# Altium project loz-old-man.PrjPcb (part 2 of 5)

## Sheet LCD_IO.SchDoc
size B; DocumentNumber: 12; SheetNumber: 12; SheetTotal: 14; PAGE_TITLE: -
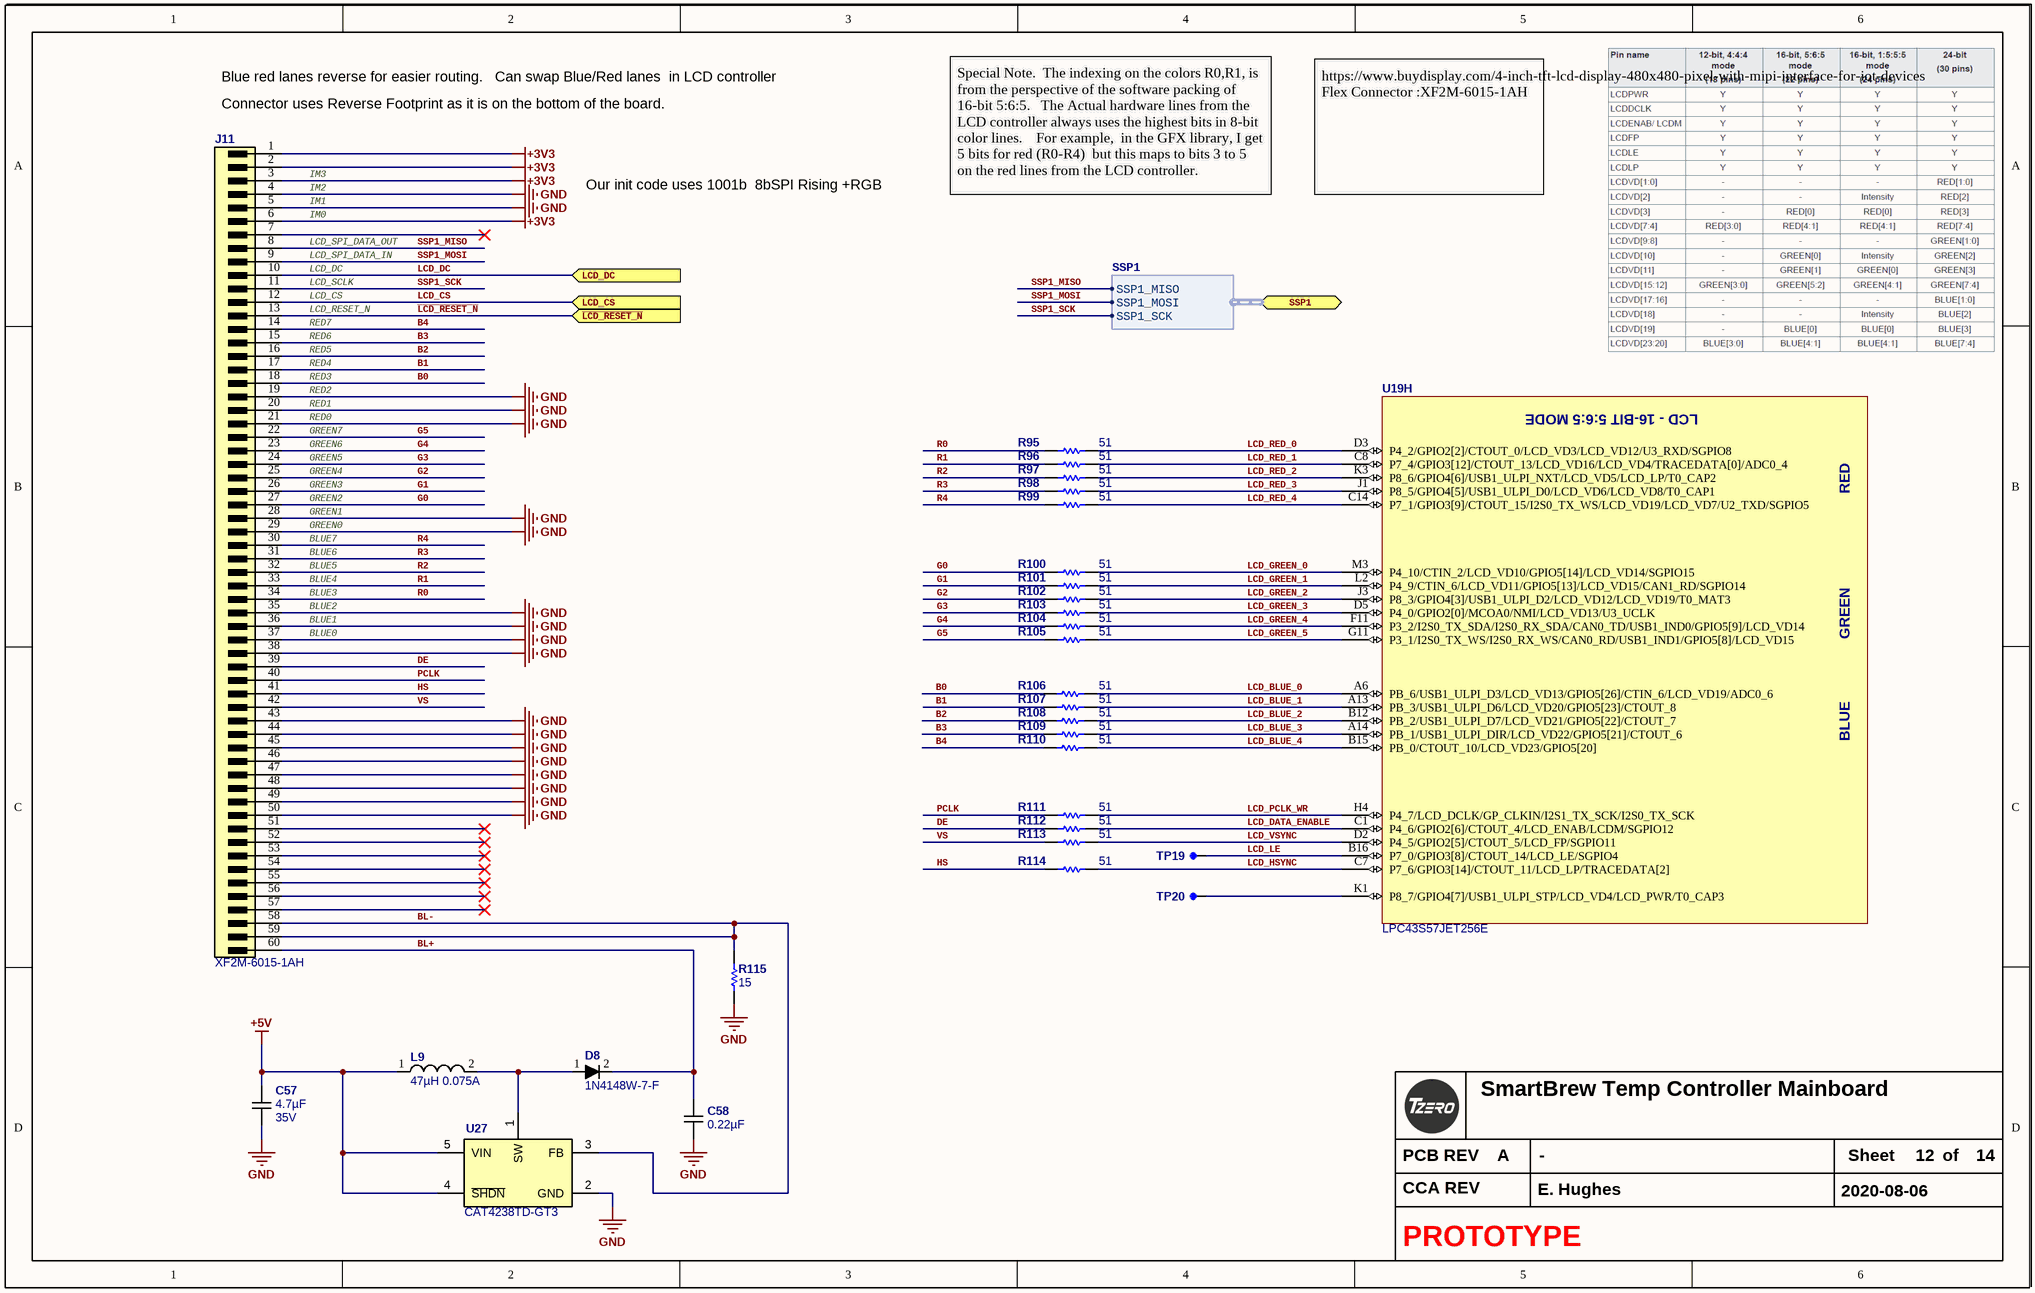
[diagram p3: LCD_IO.SchDoc]

### Parts
C57  4.7µF  Voltage - Rated: 35V  [C0805_1.50MM_HD]
C58  0.22µF  [C0603_0.90MM_HD]
D8  1N4148W-7-F  [D_SOD-123_P]
J11  XF2M-6015-1AH  [XF2M-6015-1AH - Reverse]
L9  47µH 0.075A  [L0805_1.45MM_MD]
R95  51  [R0603_0.55MM_MD]
R96  51  [R0603_0.55MM_MD]
R97  51  [R0603_0.55MM_MD]
R98  51  [R0603_0.55MM_MD]
R99  51  [R0603_0.55MM_MD]
R100  51  [R0603_0.55MM_MD]
R101  51  [R0603_0.55MM_MD]
R102  51  [R0603_0.55MM_MD]
R103  51  [R0603_0.55MM_MD]
R104  51  [R0603_0.55MM_MD]
R105  51  [R0603_0.55MM_MD]
R106  51  [R0603_0.55MM_MD]
R107  51  [R0603_0.55MM_MD]
R108  51  [R0603_0.55MM_MD]
R109  51  [R0603_0.55MM_MD]
R110  51  [R0603_0.55MM_MD]
R111  51  [R0603_0.55MM_MD]
R112  51  [R0603_0.55MM_MD]
R113  51  [R0603_0.55MM_MD]
R114  51  [R0603_0.55MM_MD]
R115  15  [R0603_0.55MM_MD]
TP19  (no value)  [TP_SMT_25_MIL_ROUND]  (net tie, no BOM)
TP20  (no value)  [TP_SMT_25_MIL_ROUND]  (net tie, no BOM)
U19  LPC43S57JET256E  [LBGA256 16X16 1700X1700X155]  (part H of 10)
U27  CAT4238TD-GT3  [SOT23-5]

### Ports
LCD_CS (in), LCD_DC (in), SSP1 (bidir, harness SSP1), ~{LCD_RESET_N} (in)

### Harnesses
SSP1: SSP1_MISO, SSP1_MOSI, SSP1_SCK

### Nets
+3V3: J11.1 J11.2 J11.3 J11.6
+5V: C57.2 L9.1 U27.4(~{SHDN}) U27.5(VIN)
GND: C57.1 C58.1 J11.4 J11.5 J11.19 J11.20 J11.21 J11.28 J11.29 J11.35 J11.36 J11.37 J11.38(XR) J11.43 J11.44 J11.45 J11.46 J11.47 J11.48 J11.49 J11.50 R115.1 U27.2(GND)
~{LCD_RESET_N}: J11.13 ; port ~{LCD_RESET_N}
B0: J11.18 R106.1
B1: J11.17 R107.1
B2: J11.16 R108.1
B3: J11.15 R109.1
B4: J11.14 R110.1
BL+: C58.2 D8.2(K) J11.60
BL-: J11.58 J11.59 R115.2 U27.3(FB)
DE: J11.39 R112.1
G0: J11.27 R100.1
G1: J11.26 R101.1
G2: J11.25 R102.1
G3: J11.24 R103.1
G4: J11.23 R104.1
G5: J11.22 R105.1
HS: J11.41 R114.1
LCD_BLUE_0: R106.2 U19.A6(PB_6/USB1_ULPI_D3/LCD_VD13/GPIO5[26]/CTIN_6/LCD_VD19/ADC0_6)
LCD_BLUE_1: R107.2 U19.A13(PB_3/USB1_ULPI_D6/LCD_VD20/GPIO5[23]/CTOUT_8)
LCD_BLUE_2: R108.2 U19.B12(PB_2/USB1_ULPI_D7/LCD_VD21/GPIO5[22]/CTOUT_7)
LCD_BLUE_3: R109.2 U19.A14(PB_1/USB1_ULPI_DIR/LCD_VD22/GPIO5[21]/CTOUT_6)
LCD_BLUE_4: R110.2 U19.B15(PB_0/CTOUT_10/LCD_VD23/GPIO5[20])
LCD_CS: J11.12 ; port LCD_CS
LCD_DATA_ENABLE: R112.2 U19.C1(P4_6/GPIO2[6]/CTOUT_4/LCD_ENAB/LCDM/SGPIO12)
LCD_DC: J11.10 ; port LCD_DC
LCD_GREEN_0: R100.2 U19.M3(P4_10/CTIN_2/LCD_VD10/GPIO5[14]/LCD_VD14/SGPIO15)
LCD_GREEN_1: R101.2 U19.L2(P4_9/CTIN_6/LCD_VD11/GPIO5[13]/LCD_VD15/CAN1_RD/SGPIO14)
LCD_GREEN_2: R102.2 U19.J3(P8_3/GPIO4[3]/USB1_ULPI_D2/LCD_VD12/LCD_VD19/T0_MAT3)
LCD_GREEN_3: R103.2 U19.D5(P4_0/GPIO2[0]/MCOA0/NMI/LCD_VD13/U3_UCLK)
LCD_GREEN_4: R104.2 U19.F11(P3_2/I2S0_TX_SDA/I2S0_RX_SDA/CAN0_TD/USB1_IND0/GPIO5[9]/LCD_VD14)
LCD_GREEN_5: R105.2 U19.G11(P3_1/I2S0_TX_WS/I2S0_RX_WS/CAN0_RD/USB1_IND1/GPIO5[8]/LCD_VD15)
LCD_HSYNC: R114.2 U19.C7(P7_6/GPIO3[14]/CTOUT_11/LCD_LP/TRACEDATA[2])
LCD_LE: TP19.1 U19.B16(P7_0/GPIO3[8]/CTOUT_14/LCD_LE/SGPIO4)
LCD_PCLK_WR: R111.2 U19.H4(P4_7/LCD_DCLK/GP_CLKIN/I2S1_TX_SCK/I2S0_TX_SCK)
LCD_RED_0: R95.2 U19.D3(P4_2/GPIO2[2]/CTOUT_0/LCD_VD3/LCD_VD12/U3_RXD/SGPIO8)
LCD_RED_1: R96.2 U19.C8(P7_4/GPIO3[12]/CTOUT_13/LCD_VD16/LCD_VD4/TRACEDATA[0]/ADC0_4)
LCD_RED_2: R97.2 U19.K3(P8_6/GPIO4[6]/USB1_ULPI_NXT/LCD_VD5/LCD_LP/T0_CAP2)
LCD_RED_3: R98.2 U19.J1(P8_5/GPIO4[5]/USB1_ULPI_D0/LCD_VD6/LCD_VD8/T0_CAP1)
LCD_RED_4: R99.2 U19.C14(P7_1/GPIO3[9]/CTOUT_15/I2S0_TX_WS/LCD_VD19/LCD_VD7/U2_TXD/SGPIO5)
LCD_VSYNC: R113.2 U19.D2(P4_5/GPIO2[5]/CTOUT_5/LCD_FP/SGPIO11)
PCLK: J11.40 R111.1
R0: J11.34 R95.1
R1: J11.33 R96.1
R2: J11.32 R97.1
R3: J11.31 R98.1
R4: J11.30 R99.1
SSP1_MISO: J11.8 ; port SSP1.SSP1_MISO
SSP1_MOSI: J11.9 ; port SSP1.SSP1_MOSI
SSP1_SCK: J11.11 ; port SSP1.SSP1_SCK
VS: J11.42 R113.1
NetD8_1: D8.1(A) L9.2 U27.1(SW)
NetTP20_1: TP20.1 U19.K1(P8_7/GPIO4[7]/USB1_ULPI_STP/LCD_VD4/LCD_PWR/T0_CAP3)

Not connected (* = marked no-connect by the designer): J11 7* 51* 52* 53* 54* 55* 56* 57*

### Notes on the sheet
- Blue red lanes reverse for easier routing.   Can swap Blue/Red lanes  in LCD controller
- (near J11) Connector uses Reverse Footprint as it is on the bottom of the board.
- (near J11) IM3
- (near J11) IM2
- (near J11) IM1
- (near J11) IM0
- Our init code uses 1001b  8bSPI Rising +RGB
- Special Note.  The indexing on the colors R0,R1, is from the perspective of the software packing of 16-bit 5:6:5.   The Actual hardware lines from the LCD controller always uses the highest bits in 8-bit color lines.    For example,  in the GFX library, I get 5 bits for red (R0-R4)  but this maps to bits 3 to 5 on the red lines from the LCD controller.
- https://www.buydisplay.com/4-inch-tft-lcd-display-480x480-pixel-with-mipi-interface-for-iot-devices
  Flex Connector :XF2M-6015-1AH
- (near J11) LCD_DC
- (near J11) LCD_SPI_DATA_OUT
- (near J11) LCD_SPI_DATA_IN
- (near J11) LCD_SCLK
- (near J11) LCD_CS
- (near J11) RED4
- (near J11) RED5
- (near J11) RED6
- (near J11) RED7
- (near J11) LCD_RESET_N
- (near J11) RED0
- (near J11) RED1
- (near J11) RED2
- (near J11) RED3
- (near J11) GREEN7
- (near J11) GREEN2
- (near J11) GREEN3
- (near J11) GREEN4
- (near J11) GREEN5
- (near J11) GREEN6
- (near J11) GREEN0
- (near J11) GREEN1
- (near J11) BLUE5
- (near J11) BLUE6
- (near J11) BLUE7
- (near J11) BLUE0
- (near J11) BLUE1
- (near J11) BLUE2
- (near J11) BLUE3
- (near J11) BLUE4
- PCB REV
- Sheet
- of
- CCA REV
- (in symbol LPC43S57JET256E, part H) LCD - 16-BIT 5:6:5 MODE; RED; GREEN; BLUE

### Library data of the parts
C57 = CGA4J1X7R1V475K125AE: CAP CER 4.7UF 35V X7R 0805; Manufacturer: TDK Corporation; Tolerance: ±10%; Substitution Notes: 4.7µF , 35V , ±10% , X7R , -55°C ~ 125°C , AEC-Q200 , 0805; Value: 4.7µF; Temperature Coefficient: X7R; Manufacturer Part Number: CGA4J1X7R1V475K125AE; ComponentLink1Description: Datasheet (Internal); ComponentLink1URL: datasheets\TDK\mlcc_automotive_general_en.pdf; ComponentLink2Description: Datasheet (External); ComponentLink2URL: https://product.tdk.com/info/en/catalog/datasheets/mlcc_automotive_general_en.pdf; Supplier 1: Digikey; Supplier Part Number 1: 445-172479-1-ND; Category: Capacitors; Features: Soft Termination; Operating Temperature: -55°C ~ 125°C; Ratings: AEC-Q200; Package: 0805; Thickness (Max): 1.50MM
C58 = CGA3E3X7R1H224K080AB: CAP CER 0.22UF 50V X7R 0603; Manufacturer: TDK Corporation; Tolerance: ±10%; Substitution Notes: 0.22µF , 50V , ±10% , X7R , -55°C ~ 125°C , AEC-Q200 , 0603; Value: 0.22µF; Temperature Coefficient: X7R; Manufacturer Part Number: CGA3E3X7R1H224K080AB; ComponentLink1Description: Datasheet (Internal); ComponentLink1URL: datasheets\TDK\mlcc_automotive_general_en.pdf; ComponentLink2Description: Datasheet (External); ComponentLink2URL: https://product.tdk.com/info/en/catalog/datasheets/mlcc_automotive_general_en.pdf; Supplier 1: Digikey; Supplier Part Number 1: 445-6926-1-ND; Category: Capacitors; Voltage - Rated: 50V; Features: -; Operating Temperature: -55°C ~ 125°C; Ratings: AEC-Q200; Package: 0603; Thickness (Max): 0.90MM
D8 = 1N4148W-7-F: DIODE SWITCH 100V 150MA SOD123; Manufacturer: Diodes Inc; CategorySort: 400; Diode Type: Standard; Voltage - Forward (Vf) (Max) @ If: 1.25V @ 150mA; Speed: Small Signal =< 200mA (Io)- Any Speed; Reverse Recovery Time (trr): 4ns; Current - Reverse Leakage @ Vr: 1µA @ 75V; Capacitance @ Vr- F: 2pF @ 0V- 1MHz; Num Pins: 2; Diode Suffix: 1A_2C; Category: Diodes; Value: 1N4148W-7-F; Manufacturer Part Number: 1N4148W-7-F; ComponentLink1Description: Internal Datasheet; ComponentLink1URL: http://www.diodes.com/datasheets/ds30086.pdf; ComponentLink2Description: External Datasheet; ComponentLink2URL: http://www.diodes.com/datasheets/ds30086.pdf; Supplier 1: Digi-Key; Supplier Part Number 1: 1N4148W-FDICT-ND; SortValue: 1N4148W-7-F; Voltage - DC Reverse (Vr) (Max): 100V; Current - Average Rectified (Io): 150mA; Mounting Type: Surface Mount; Package: SOD-123; Supplier Device Package: SOD-123; Packaging: Cut Tape (CT)
J11 = XF2M-6015-1AH: CONN FPC 60POS 0.50MM R/A; Manufacturer: Omron; Actuator Material: Polymer,Liquid Crystal Polymer; Voltage Rating: 50V; Current Rating: 500mA; Number of Positions: 60; Gender: Receptacle; Pitch: 0.5mm; Contact Resistance: 50mR; Value: XF2M-6015-1AH; Supplier 1: Newark; Manufacturer Part Number: XF2M-6015-1AH; Stock 1: 1054; Pricing 1: 1=0.63900, 10=0.63900, 25=0.63900, 50=0.63900, 100=0.63900, 250=0.63900, 500=0.63900 (USD); RoHS: Yes; Mount: Surface Mount; Contact Material: Copper Alloy; Contact Plating: Gold; Housing Material: Polymer; Min Operating Temperature: -30°C; Max Operating Temperature: 85°C; Packaging: Tape and Reel; Number of Rows: 1; Termination: Solder; Orientation: Right Angle; Package Quantity: 1; Flammability Rating: UL94 V-0; REACH SVHC: Unknown; ComponentLink1URL: https://datasheet.ciiva.com/26945/getdatasheetpartid-792262-26945584.pdf?src-supplier=Verical; ComponentLink1Description: https://datasheet.ciiva.com/26945/getdatasheetpartid-792262-26945584.pdf?src-supplier=Verical; ComponentLink2URL: https://datasheet.ciiva.com/672/en-xf2m-672256.pdf?src-supplier=Digi-Key; ComponentLink2Description: https://datasheet.ciiva.com/672/en-xf2m-672256.pdf?src-supplier=Digi-Key; ComponentLink3URL: https://datasheet.ciiva.com/10367/xf2m-10367321.pdf?src-supplier=Avnet; ComponentLink3Description: https://datasheet.ciiva.com/10367/xf2m-10367321.pdf?src-supplier=Avnet; ComponentLink4URL: https://datasheet.ciiva.com/16122/en-xf2m-16122554.pdf?src-supplier=Onlinecomponents.com; ComponentLink4Description: https://datasheet.ciiva.com/16122/en-xf2m-16122554.pdf?src-supplier=Onlinecomponents.com; Supplier Part Number 1: 88M4894; Housing Color: Natural; Max Current Rating: 500mA; Max Voltage Rating (DC): 50V; Max Voltage Rating (AC): 50V; Number of Contacts: 60; Length: 34.1mm; Depth: 6.2mm; Lead Free: Lead Free; ComponentLink5URL: https://datasheet.ciiva.com/672/en-xf2m-672255.pdf?src-supplier=Digi-Key; ComponentLink5Description: https://datasheet.ciiva.com/672/en-xf2m-672255.pdf?src-supplier=Digi-Key; ComponentLink6URL: https://datasheet.ciiva.com/7989/1465437-7989453.pdf?src-supplier=Element14; ComponentLink6Description: https://datasheet.ciiva.com/7989/1465437-7989453.pdf?src-supplier=Element14; ComponentLink7URL: https://datasheet.ciiva.com/672/en-xf2m-672254.pdf?src-supplier=Digi-Key; ComponentLink7Description: https://datasheet.ciiva.com/672/en-xf2m-672254.pdf?src-supplier=Digi-Key
L9 = LBR2012T470KV: Inductor 47µH 0.075A; Manufacturer: Taiyo Yuden; CategorySort: 300; Inductance (uH): 47; Tolerance: ±10%; DCR Max (Ohms): 1.7Ohm; SRF typ (MHz): 11MHz; Isat (A): 0.075; Shielding: Unshielded; Category: Inductors; Value: 47µH 0.075A; Part Number: LBR2012T470KV; ComponentLink1Description: External Datasheet; ComponentLink1URL: https://ds.yuden.co.jp/TYCOMPAS/ut/detail?pn=LBR2012T470KV  &u=M; Sort Value: 47_0.075; Sort Value Package: 47_0.075_0805; Manufacturer Part Number: LBR2012T470KV; IRMS: 0.075; Supplier 1: Digikey; Supplier Part Number 1: 587-4044-1-ND; Supplier Unit Price 1: 0.25; Package: 0805; Height (mm): 1.45MM; Rating: AEC-Q200
R95-R114 = ERJ-3EKF51R0V: RES 51 OHM 1/10W 1% 0603 SMD; Manufacturer: Panasonic Electronic Components; Package Power: 0603  (0.1W); Power (Watts): 0.1W- 1/10W; Temperature Coefficient: ±100ppm/°C; Limiting Element Voltage: 75; Maximum Overload Voltage: 150; Maximum Working Voltage: 2.3V; Substitution Notes: 51 , ±1% , 0603 , AEC-Q200; Value: 51; Manufacturer Part Number: ERJ-3EKF51R0V; ComponentLink1Description: Internal Datasheet; ComponentLink1URL: datasheets\Panasonic Electronic Components\AOA0000CE2.pdf; ComponentLink2Description: External Datasheet; ComponentLink2URL: http://industrial.panasonic.com/www-data/pdf/AOA0000/AOA0000CE2.pdf; Supplier 1: Digi-Key; Supplier Part Number 1: P51.0HCT-ND; Category: Resistors; Resistance (Ohms): 51; Composition: Thick Film; Features: -; Tolerance: ±1%; Package: 0603 (1608 Metric); Supplier Package: 0603; Size / Dimension: 0.063" L x 0.031" W (1.60mm x 0.80mm); Height: 0.55MM; Number of Terminations: 2; Packaging: Cut Tape (CT); Sort Value: 51; Sort Value Package: 603_51; Ratings: AEC-Q200
R115 = ERJ-3EKF15R0V: RES 15 OHM 1/10W 1% 0603 SMD; Manufacturer: Panasonic Electronic Components; Package Power: 0603  (0.1W); Power (Watts): 0.1W- 1/10W; Temperature Coefficient: ±100ppm/°C; Limiting Element Voltage: 75; Maximum Overload Voltage: 150; Maximum Working Voltage: 1.2V; Substitution Notes: 15 , ±1% , 0603 , AEC-Q200; Value: 15; Manufacturer Part Number: ERJ-3EKF15R0V; ComponentLink1Description: Internal Datasheet; ComponentLink1URL: datasheets\Panasonic Electronic Components\AOA0000CE2.pdf; ComponentLink2Description: External Datasheet; ComponentLink2URL: http://industrial.panasonic.com/www-data/pdf/AOA0000/AOA0000CE2.pdf; Supplier 1: Digi-Key; Supplier Part Number 1: P15.0HCT-ND; Category: Resistors; Resistance (Ohms): 15; Composition: Thick Film; Features: -; Tolerance: ±1%; Package: 0603 (1608 Metric); Supplier Package: 0603; Size / Dimension: 0.063" L x 0.031" W (1.60mm x 0.80mm); Height: 0.55MM; Number of Terminations: 2; Packaging: Cut Tape (CT); Sort Value: 15; Sort Value Package: 603_15; Ratings: AEC-Q200
TP19 TP20 = TP SMT 25MIL: Sort Value: *; Category: *; CategorySort: *
U19 = LPC43S57JET256E: ARM Microcontrollers - MCU CortexM0/4 32bit 1MB Cortex-M4/M0; Manufacturer: NXP Semiconductors; CategorySort: 600; Data RAM Size: 136 KB; Core: ARM Cortex M4/M0; Maximum Clock Frequency: 204 MHz; On-Chip ADC: Yes; Operating Supply Voltage: 2.2 V to 3.6 V; Processor Series: LPC4357; Product Status: New Technology; Value: LPC43S57JET256E; Sort Value: *; Category: Integrated Circuits; Supplier 1: Digi-Key; Supplier Part Number 1: 568-11712-ND; Manufacturer Part Number: LPC43S57JET256E; RoHS: RoHS Compliant; Stock 1: 108; Pricing 1: 1=14.40, 25=13.31, 100=12.24, 250=11.16, 500=10.43, 1000=9.57 (USD); Package: LBGA-256; Packaging: Tray; Mounting Style: SMD/SMT; Program Memory Size: 1 MB; Data Bus Width: 32 bit; Maximum Operating Temperature: + 85 C; Minimum Operating Temperature: - 40 C; Standard Pack Qty: 90; Tradename: LPC; RoHS - Mouser: Y; Minimum Order Quantity: 1; Reeling: False; ComponentLink1URL: http://www.nxp.com/documents/data_sheet/LPC4357_53_37_33.pdf; ComponentLink1Description: http://www.nxp.com/documents/data_sheet/LPC4357_53_37_33.pdf
U27 = CAT4238TD-GT3: IC LED DRIVER RGLTR DIM TSOT23-5; Manufacturer: ON Semiconductor; Output Current: 450mA; Output Voltage: 38V; Max Supply Voltage: 5.5V; Number of Outputs: 1; Frequency: 1.3MHz; Min Input Voltage: 2V; Switching Frequency: 1MHz; Max Supply Current: 1.5mA; High Level Output Current: 40mA; Number of Segments: 10; Topology: Boost; Min Supply Voltage: 2.8V; Current Rating: 30mA; Efficiency: 87%; Min Output Voltage: 0uV; Value: CAT4238TD-GT3; Supplier 1: Digi-Key; Supplier Part Number 1: CAT4238TD-GT3CT-ND; Manufacturer Part Number: CAT4238TD-GT3; RoHS: Yes; Category: Embedded Processors and Controllers; Stock: 29128; Pricing: 1=1.08000, 10=0.96100, 100=0.70040, 500=0.58642, 1000=0.45611 (USD); Case/Package: TSOT; Number of Pins: 5; Contact Plating: Gold; Min Operating Temperature: -40°C; Max Operating Temperature: 85°C; Package Quantity: 1; Max Input Voltage: 5.5V; Packaging: Tape and Reel; Output Current per Channel: 40mA; Max Output Voltage: 38V; Nominal Supply Current: 1.5mA; Termination: SMD/SMT; Radiation Hardening: No; REACH SVHC: No SVHC; Lead Free: Lead Free; Halogen Free: Halogen Free; ComponentLink1URL: https://datasheet.ciiva.com/4426/cat4238-d-109064-4426950.pdf?src-supplier=Mouser; ComponentLink1Description: https://datasheet.ciiva.com/4426/cat4238-d-109064-4426950.pdf?src-supplier=Mouser; ComponentLink2URL: https://datasheet.ciiva.com/1552/83817-1552601.pdf?src-supplier=Farnell; ComponentLink2Description: https://datasheet.ciiva.com/1552/83817-1552601.pdf?src-supplier=Farnell; ComponentLink3URL: https://datasheet.ciiva.com/15135/getdatasheetpartid-558497-15135587.pdf?src-supplier=Verical; ComponentLink3Description: https://datasheet.ciiva.com/15135/getdatasheetpartid-558497-15135587.pdf?src-supplier=Verical; ComponentLink4URL: https://datasheet.ciiva.com/5775/cat4238-d-5775332.pdf?src-supplier=Farnell; ComponentLink4Description: https://datasheet.ciiva.com/5775/cat4238-d-5775332.pdf?src-supplier=Farnell; ComponentLink5URL: https://datasheet.ciiva.com/26878/cat4238td-gt3-26878318.pdf?src-supplier=IIIC; ComponentLink5Description: https://datasheet.ciiva.com/26878/cat4238td-gt3-26878318.pdf?src-supplier=IIIC; ComponentLink6URL: https://datasheet.ciiva.com/16387/cat4238-d-16387237.pdf?src-supplier=Future+Electronics; ComponentLink6Description: https://datasheet.ciiva.com/16387/cat4238-d-16387237.pdf?src-supplier=Future+Electronics; ComponentLink7URL: https://datasheet.ciiva.com/1945/cat4238-d-1945306.pdf?src-supplier=Digi-Key; ComponentLink7Description: https://datasheet.ciiva.com/1945/cat4238-d-1945306.pdf?src-supplier=Digi-Key; ComponentLink8URL: https://datasheet.ciiva.com/46408/cat4238-d-46408090.pdf?src-supplier=Element14; ComponentLink8Description: https://datasheet.ciiva.com/46408/cat4238-d-46408090.pdf?src-supplier=Element14; ComponentLink9URL: https://datasheet.ciiva.com/1945/cat4238-d-1945307.pdf?src-supplier=Digi-Key; ComponentLink9Description: https://datasheet.ciiva.com/1945/cat4238-d-1945307.pdf?src-supplier=Digi-Key; ComponentLink10URL: https://datasheet.ciiva.com/26062/cat4238-d-26062715.pdf?src-supplier=Avnet+Europe; ComponentLink10Description: https://datasheet.ciiva.com/26062/cat4238-d-26062715.pdf?src-supplier=Avnet+Europe; ComponentLink11URL: https://datasheet.ciiva.com/1497/cat4238-d-1497804.pdf?src-supplier=Element14; ComponentLink11Description: https://datasheet.ciiva.com/1497/cat4238-d-1497804.pdf?src-supplier=Element14; ComponentLink12URL: https://datasheet.ciiva.com/1945/cat4238-d-1945308.pdf?src-supplier=Digi-Key; ComponentLink12Description: https://datasheet.ciiva.com/1945/cat4238-d-1945308.pdf?src-supplier=Digi-Key; ComponentLink13URL: https://datasheet.ciiva.com/3165/cat4238-d-3165884.pdf?src-supplier=Avnet; ComponentLink13Description: https://datasheet.ciiva.com/3165/cat4238-d-3165884.pdf?src-supplier=Avnet; ComponentLink14URL: https://datasheet.ciiva.com/7650/83817-7650460.pdf?src-supplier=Element14; ComponentLink14Description: https://datasheet.ciiva.com/7650/83817-7650460.pdf?src-supplier=Element14

## Sheet SensorInterface.SchDoc
size B; DocumentNumber: 4; SheetNumber: 4; SheetTotal: 14; PAGE_TITLE: -
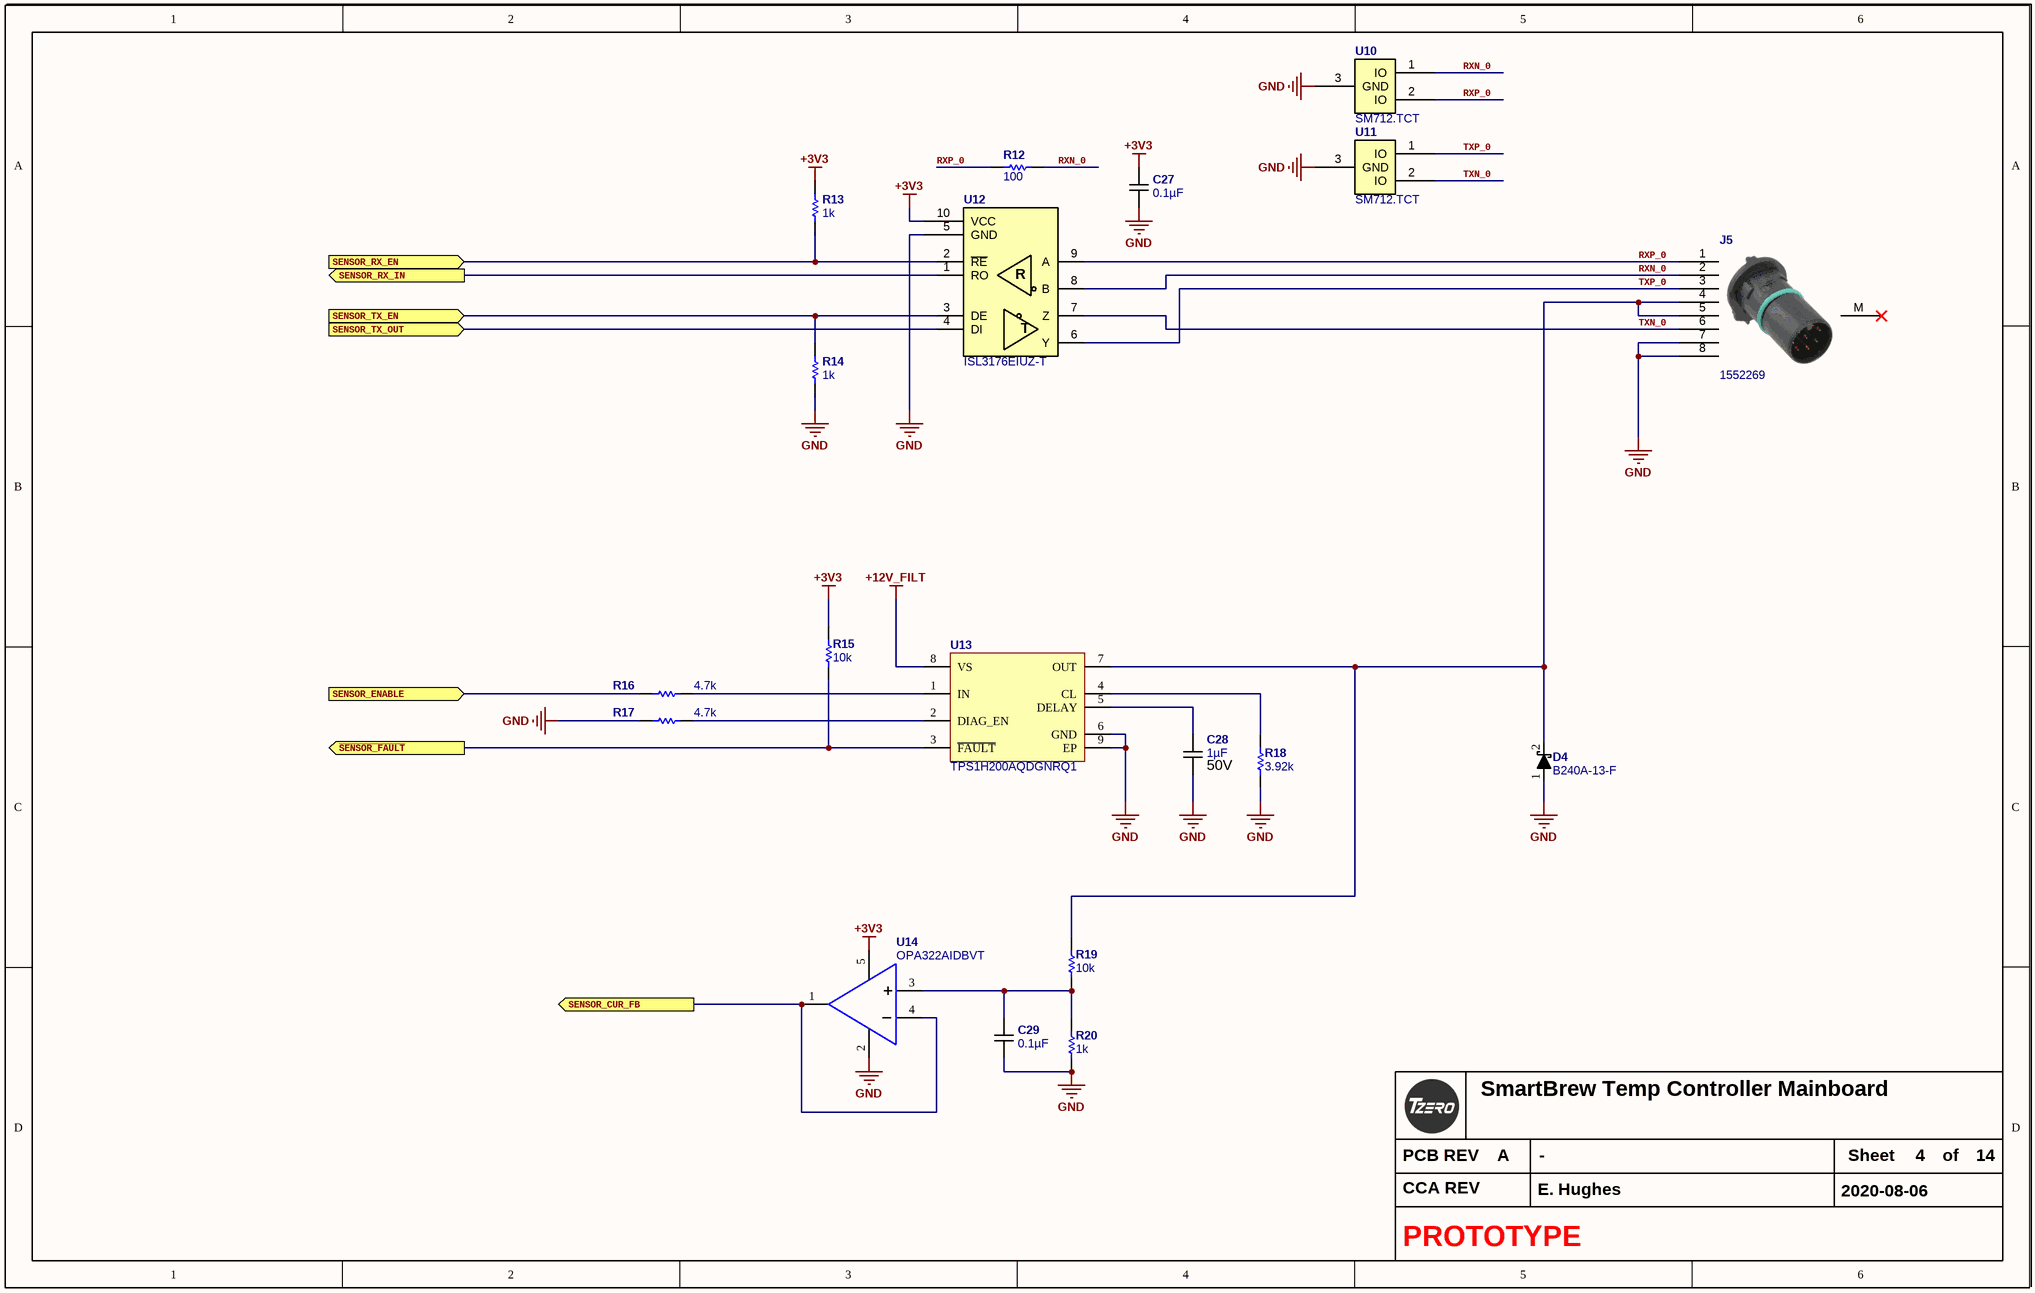
[diagram p4: SensorInterface.SchDoc]

### Parts
C27  0.1µF  [C0402_0.55MM_HD]
C28  1µF  Voltage - Rated: 50V  [C0805_1.50MM_MD]
C29  0.1µF  [C0402_0.55MM_HD]
D4  B240A-13-F  [D_SMA_P]
J5  1552269  [1552269]
R12  100  [R0603_0.55MM_MD]
R13  1k  [R0603_0.55MM_MD]
R14  1k  [R0603_0.55MM_MD]
R15  10k  [R0603_0.55MM_MD]
R16  4.7k  [R0603_0.55MM_MD]
R17  4.7k  [R0603_0.55MM_MD]
R18  3.92k  [R0603_0.55MM_MD]
R19  10k  [R0603_0.55MM_MD]
R20  1k  [R0603_0.55MM_MD]
U10  SM712.TCT  [SOT-23]
U11  SM712.TCT  [SOT-23]
U12  ISL3176EIUZ-T  [10 MSOP]
U13  TPS1H200AQDGNRQ1  [TI_DGN_MD]
U14  OPA322AIDBVT  [SOT23-5]

### Ports
SENSOR_CUR_FB (out), SENSOR_ENABLE (in), SENSOR_RX_EN (in), SENSOR_RX_IN (out), SENSOR_TX_EN (in), SENSOR_TX_OUT (in), ~{SENSOR_FAULT} (out)

### Nets
+3V3: C27.2 R13.1 R15.2 U12.10(VCC) U14.5(VCC)
+12V_FILT: U13.8(VS)
GND: C27.1 C28.1 C29.1 D4.1(A) J5.7 J5.8 R14.2 R17.1 R18.1 R20.2 U10.3(GND) U11.3(GND) U12.5(GND) U13.6(GND) U13.9(EP) U14.2(GND)
~{SENSOR_FAULT}: R15.1 U13.3(~{FAULT}) ; port ~{SENSOR_FAULT}
RXN_0: J5.2 R12.2 U10.1(IO) U12.8(B)
RXP_0: J5.1 R12.1 U10.2(IO) U12.9(A)
SENSOR_CUR_FB: U14.1(OUT) U14.4(-) ; port SENSOR_CUR_FB
SENSOR_ENABLE: R16.1 ; port SENSOR_ENABLE
SENSOR_RX_EN: R13.2 U12.2(~{RE}) ; port SENSOR_RX_EN
SENSOR_RX_IN: U12.1(RO) ; port SENSOR_RX_IN
SENSOR_TX_EN: R14.1 U12.3(DE) ; port SENSOR_TX_EN
SENSOR_TX_OUT: U12.4(DI) ; port SENSOR_TX_OUT
TXN_0: J5.6 U11.2(IO) U12.7(Z)
TXP_0: J5.3 U11.1(IO) U12.6(Y)
NetC28_2: C28.2 U13.5(DELAY)
NetC29_2: C29.2 R19.1 R20.1 U14.3(+)
NetD4_2: D4.2(K) J5.4 J5.5 R19.2 U13.7(OUT)
NetR16_2: R16.2 U13.1(IN)
NetR17_2: R17.2 U13.2(DIAG_EN)
NetR18_2: R18.2 U13.4(CL)

Not connected (* = marked no-connect by the designer): J5 M*

### Notes on the sheet
- PCB REV
- Sheet
- of
- CCA REV
- (in symbol ISL3176EIUZ-T) R; T

### Library data of the parts
C27 C29 = CGA2B3X7R1E104K050BB: CAP CER 0.1UF 25V X7R 0402; Manufacturer: TDK Corporation; Tolerance: ±10%; Substitution Notes: 0.1µF , 25V , ±10% , X7R , -55°C ~ 125°C , AEC-Q200 , 0402; Value: 0.1µF; Temperature Coefficient: X7R; Manufacturer Part Number: CGA2B3X7R1E104K050BB; ComponentLink1Description: Datasheet (Internal); ComponentLink1URL: datasheets\TDK\mlcc_automotive_general_en.pdf; ComponentLink2Description: Datasheet (External); ComponentLink2URL: https://product.tdk.com/info/en/catalog/datasheets/mlcc_automotive_general_en.pdf; Supplier 1: Digikey; Supplier Part Number 1: 445-6902-1-ND; Category: Capacitors; Voltage - Rated: 25V; Features: -; Operating Temperature: -55°C ~ 125°C; Ratings: AEC-Q200; Package: 0402; Thickness (Max): 0.55MM
C28 = CGA4J3X7R1H105M125AE: CAP CER 1UF 50V X7R 0805; Manufacturer: TDK Corporation; Tolerance: ±20%; Substitution Notes: 1µF , 50V , ±20% , X7R , -55°C ~ 125°C , AEC-Q200 , 0805; Value: 1µF; Temperature Coefficient: X7R; Manufacturer Part Number: CGA4J3X7R1H105M125AE; ComponentLink1Description: Datasheet (Internal); ComponentLink1URL: datasheets\TDK\mlcc_automotive_general_en.pdf; ComponentLink2Description: Datasheet (External); ComponentLink2URL: https://product.tdk.com/info/en/catalog/datasheets/mlcc_automotive_general_en.pdf; Supplier 1: Digikey; Supplier Part Number 1: 445-7958-1-ND; Category: Capacitors; Features: Soft Termination; Operating Temperature: -55°C ~ 125°C; Ratings: AEC-Q200; Package: 0805; Thickness (Max): 1.50MM
D4 = B240A-13-F: DIODE SCHOTTKY 40V 2A SMA; Manufacturer: Diodes Inc; CategorySort: 400; Voltage - Forward (Vf) (Max) @ If: 500mV @ 2A; Speed: Fast Recovery =< 500ns- > 200mA (Io); Current - Reverse Leakage @ Vr: 500µA @ 40V; Capacitance @ Vr- F: 200pF @ 4V- 1MHz; Num Pins: 2; Diode Suffix: 1A_2C; Category: Diodes; Value: B240A-13-F; Manufacturer Part Number: B240A-13-F; ComponentLink1Description: Internal Datasheet; ComponentLink1URL: http://www.diodes.com/datasheets/ds13004.pdf; ComponentLink2Description: External Datasheet; ComponentLink2URL: http://www.diodes.com/datasheets/ds13004.pdf; Stocked: -; Supplier 1: Digi-Key; Supplier Part Number 1: B240A-FDICT-ND; SortValue: B240A-13-F; Pricing: 1 = 0.54  ;  10 = 0.38  ;  25 = 0.312  ;  100 = 0.2492  ;  250 = 0.18152  ;  500 = 0.1474  ;  1000 = 0.1133  ;  2500 = 0.10175 (USD); Sales Status: Active; Diode Type: Schottky; Voltage - DC Reverse (Vr) (Max): 40V; Current - Average Rectified (Io): 2A; Reverse Recovery Time (trr): -; Mounting Type: Surface Mount; Package: DO-214AC- SMA; Supplier Device Package: SMA; Packaging: Cut Tape (CT)
J5 = 1552269: Circular Metric Connectors SACC-DSI-FSD -4CON-PG9/0,5 SCO; Manufacturer: Phoenix Contact; Current Rating: 2A; Voltage Rating: 30V; Number of Positions: 8; Connector Type: Plug; Strain Relief: No (Without); Thread Size: M12; Ratings: IP67,Waterproof,Dust Tight; Value: 1552269; Supplier 1: Digi-Key; Supplier Part Number 1: 277-8390-ND; Manufacturer Part Number: 1552269; RoHS: Yes; Category: Circular Connectors; Stock: 60; Pricing: 1=11.18000, 10=10.69000, 50=10.39880, 100=9.71850, 250=8.94108, 500=8.26078, 1000=7.87201 (USD); Mount: Through Hole; Weight: 0.128397oz; Contact Plating: Gold; Contact Material: Brass; Min Operating Temperature: -25°C; Max Operating Temperature: 85°C; Packaging: Tray; Package Quantity: 1; Fastening Type: Threaded; Termination: Solder; Number of Contacts: 8; Max Current Rating: 2A; Contact Gender: Female; Orientation: Straight; Radiation Hardening: No; Lead Free: Lead Free; ComponentLink1URL: https://datasheet.ciiva.com/15179/getdatasheetpartid-320397-15179574.pdf?src-supplier=Verical; ComponentLink1Description: https://datasheet.ciiva.com/15179/getdatasheetpartid-320397-15179574.pdf?src-supplier=Verical
R12 = ERJ-3EKF1000V: RES 100 OHM 1/10W 1% 0603 SMD; Manufacturer: Panasonic Electronic Components; Package Power: 0603  (0.1W); Power (Watts): 0.1W- 1/10W; Temperature Coefficient: ±100ppm/°C; Limiting Element Voltage: 75; Maximum Overload Voltage: 150; Maximum Working Voltage: 3.2V; Substitution Notes: 100 , ±1% , 0603 , AEC-Q200; Value: 100; Manufacturer Part Number: ERJ-3EKF1000V; ComponentLink1Description: Internal Datasheet; ComponentLink1URL: datasheets\Panasonic Electronic Components\AOA0000CE2.pdf; ComponentLink2Description: External Datasheet; ComponentLink2URL: http://industrial.panasonic.com/www-data/pdf/AOA0000/AOA0000CE2.pdf; Supplier 1: Digi-Key; Supplier Part Number 1: P100HCT-ND; Category: Resistors; Resistance (Ohms): 100; Composition: Thick Film; Features: -; Tolerance: ±1%; Package: 0603 (1608 Metric); Supplier Package: 0603; Size / Dimension: 0.063" L x 0.031" W (1.60mm x 0.80mm); Height: 0.55MM; Number of Terminations: 2; Packaging: Cut Tape (CT); Sort Value: 100; Sort Value Package: 603_100; Ratings: AEC-Q200
R13 R14 R20 = ERJ-3EKF1001V: RES 1K OHM 1/10W 1% 0603 SMD; Manufacturer: Panasonic Electronic Components; Package Power: 0603  (0.1W); Power (Watts): 0.1W- 1/10W; Temperature Coefficient: ±100ppm/°C; Limiting Element Voltage: 75; Maximum Overload Voltage: 150; Maximum Working Voltage: 10.0V; Substitution Notes: 1k , ±1% , 0603 , AEC-Q200; Value: 1k; Manufacturer Part Number: ERJ-3EKF1001V; ComponentLink1Description: Internal Datasheet; ComponentLink1URL: datasheets\Panasonic Electronic Components\AOA0000CE2.pdf; ComponentLink2Description: External Datasheet; ComponentLink2URL: http://industrial.panasonic.com/www-data/pdf/AOA0000/AOA0000CE2.pdf; Supplier 1: Digi-Key; Supplier Part Number 1: P1.00KHCT-ND; Category: Resistors; Resistance (Ohms): 1k; Composition: Thick Film; Features: -; Tolerance: ±1%; Package: 0603 (1608 Metric); Supplier Package: 0603; Size / Dimension: 0.063" L x 0.031" W (1.60mm x 0.80mm); Height: 0.55MM; Number of Terminations: 2; Packaging: Cut Tape (CT); Sort Value: 1000; Sort Value Package: 603_1000; Ratings: AEC-Q200
R15 R19 = ERJ-3EKF1002V: RES 10K OHM 1/10W 1% 0603 SMD; Manufacturer: Panasonic Electronic Components; Package Power: 0603  (0.1W); Power (Watts): 0.1W- 1/10W; Temperature Coefficient: ±100ppm/°C; Limiting Element Voltage: 75; Maximum Overload Voltage: 150; Maximum Working Voltage: 31.6V; Substitution Notes: 10k , ±1% , 0603 , AEC-Q200; Value: 10k; Manufacturer Part Number: ERJ-3EKF1002V; ComponentLink1Description: Internal Datasheet; ComponentLink1URL: datasheets\Panasonic Electronic Components\AOA0000CE2.pdf; ComponentLink2Description: External Datasheet; ComponentLink2URL: http://industrial.panasonic.com/www-data/pdf/AOA0000/AOA0000CE2.pdf; Supplier 1: Digi-Key; Supplier Part Number 1: P10.0KHCT-ND; Category: Resistors; Resistance (Ohms): 10k; Composition: Thick Film; Features: -; Tolerance: ±1%; Package: 0603 (1608 Metric); Supplier Package: 0603; Size / Dimension: 0.063" L x 0.031" W (1.60mm x 0.80mm); Height: 0.55MM; Number of Terminations: 2; Packaging: Cut Tape (CT); Sort Value: 10000; Sort Value Package: 603_10000; Ratings: AEC-Q200
R16 R17 = ERJ-3EKF4701V: RES 4.7K OHM 1/10W 1% 0603 SMD; Manufacturer: Panasonic Electronic Components; Package Power: 0603  (0.1W); Power (Watts): 0.1W- 1/10W; Temperature Coefficient: ±100ppm/°C; Limiting Element Voltage: 75; Maximum Overload Voltage: 150; Maximum Working Voltage: 21.7V; Substitution Notes: 4.7k , ±1% , 0603 , AEC-Q200; Value: 4.7k; Manufacturer Part Number: ERJ-3EKF4701V; ComponentLink1Description: Internal Datasheet; ComponentLink1URL: datasheets\Panasonic Electronic Components\AOA0000CE2.pdf; ComponentLink2Description: External Datasheet; ComponentLink2URL: http://industrial.panasonic.com/www-data/pdf/AOA0000/AOA0000CE2.pdf; Supplier 1: Digi-Key; Supplier Part Number 1: P4.70KHCT-ND; Category: Resistors; Resistance (Ohms): 4.7k; Composition: Thick Film; Features: -; Tolerance: ±1%; Package: 0603 (1608 Metric); Supplier Package: 0603; Size / Dimension: 0.063" L x 0.031" W (1.60mm x 0.80mm); Height: 0.55MM; Number of Terminations: 2; Packaging: Cut Tape (CT); Sort Value: 4700; Sort Value Package: 603_4700; Ratings: AEC-Q200
R18 = ERJ-3EKF3921V: RES 3.92K OHM 1/10W 1% 0603 SMD; Manufacturer: Panasonic Electronic Components; Package Power: 0603  (0.1W); Power (Watts): 0.1W- 1/10W; Temperature Coefficient: ±100ppm/°C; Limiting Element Voltage: 75; Maximum Overload Voltage: 150; Maximum Working Voltage: 19.8V; Substitution Notes: 3.92k , ±1% , 0603 , AEC-Q200; Value: 3.92k; Manufacturer Part Number: ERJ-3EKF3921V; ComponentLink1Description: Internal Datasheet; ComponentLink1URL: datasheets\Panasonic Electronic Components\AOA0000CE2.pdf; ComponentLink2Description: External Datasheet; ComponentLink2URL: http://industrial.panasonic.com/www-data/pdf/AOA0000/AOA0000CE2.pdf; Supplier 1: Digi-Key; Supplier Part Number 1: P3.92KHCT-ND; Category: Resistors; Resistance (Ohms): 3.92k; Composition: Thick Film; Features: -; Tolerance: ±1%; Package: 0603 (1608 Metric); Supplier Package: 0603; Size / Dimension: 0.063" L x 0.031" W (1.60mm x 0.80mm); Height: 0.55MM; Number of Terminations: 2; Packaging: Cut Tape (CT); Sort Value: 3920; Sort Value Package: 603_3920; Ratings: AEC-Q200
U10 U11 = SM712.TCT: TVS DIODE 12VWM/7VWM SOT23; Manufacturer: Semtech; Direction: Bidirectional; Number of Elements: 2; Reverse Breakdown Voltage: 13.3V; Reverse Standoff Voltage: 12V; Min Breakdown Voltage: 7.5V; Clamping Voltage: 26V; Peak Pulse Power: 400W; Power Line Protection: No; Leakage Current: 1uA; Peak Pulse Current: 17A; Test Current: 1mA; ESD Protection: Yes; Max Reverse Leakage Current: 20uA; Element Configuration: Dual; ComponentLink1URL: https://datasheet.ciiva.com/16393/sm712-16393584.pdf; ComponentLink1Description: https://datasheet.ciiva.com/16393/sm712-16393584.pdf; ComponentLink2URL: https://datasheet.ciiva.com/339/sm712-339089.pdf; ComponentLink2Description: https://datasheet.ciiva.com/339/sm712-339089.pdf; ComponentLink3URL: https://datasheet.ciiva.com/339/sm712-339090.pdf; ComponentLink3Description: https://datasheet.ciiva.com/339/sm712-339090.pdf; ComponentLink4URL: https://datasheet.ciiva.com/339/sm712-339091.pdf; ComponentLink4Description: https://datasheet.ciiva.com/339/sm712-339091.pdf; ComponentLink5URL: https://datasheet.ciiva.com/18065/getdatasheetpartid-110620-18065348.pdf; ComponentLink5Description: https://datasheet.ciiva.com/18065/getdatasheetpartid-110620-18065348.pdf; ComponentLink6URL: https://datasheet.ciiva.com/25958/sm712-25958326.pdf; ComponentLink6Description: https://datasheet.ciiva.com/25958/sm712-25958326.pdf; ComponentLink7URL: https://datasheet.ciiva.com/5748/579001-5748455.pdf; ComponentLink7Description: https://datasheet.ciiva.com/5748/579001-5748455.pdf; ComponentLink8URL: https://datasheet.ciiva.com/8029/579001-8029931.pdf; ComponentLink8Description: https://datasheet.ciiva.com/8029/579001-8029931.pdf; Supplier 1: Digi-Key; Supplier Part Number 1: SM712CT-ND; Manufacturer Part Number: SM712.TCT; Stock 1: 46130; Pricing 1: 1=1.79, 10=1.615, 25=1.442, 100=1.2978, 250=1.1536, 500=1.0094, 1000=0.8364 (USD); Mount: Surface Mount; Case/Package: SOT-23; Number of Pins: 3; Min Operating Temperature: -55°C; Max Operating Temperature: 125°C; Packaging: Tape and Reel; Number of Bidirectional Channels: 2; Power Dissipation: 400W; Polarity: Bidirectional; Working Voltage: 12V; Max Breakdown Voltage: 13.3V; Max Power Dissipation: 400W; Voltage Rating (DC): 12V; Breakdown Voltage: 13.3V; Length: 2.9mm; Height: 0.95mm; Width: 1.3mm; Depth: 1.3mm; Radiation Hardening: No; REACH SVHC: No SVHC; Lead Free: Lead Free; Value: SM712.TCT
U12 = ISL3176EIUZ-T: IC TXRX RS422/485 20MBPS 10MSOP; Manufacturer: Intersil; Protocol: RS422, RS485; Number of Drivers/Receivers: 1/1; Duplex: Full; Voltage - Supply: 3 V ~ 3.6 V; Value: ISL3176EIUZ-T; Supplier 1: Digi-Key; Supplier Part Number 1: ISL3176EIUZ-TCT-ND; Manufacturer Part Number: ISL3176EIUZ-T; RoHS: RoHS Compliant; Category: Integrated Circuits (ICs); Stock 1: 9164; Pricing 1: 1=1.79, 10=1.61, 100=1.2944, 500=1.06348, 1000=0.88117 (USD); Packaging: Cut Tape (CT); Part Status: Active; Type: Transceiver; Data Rate: 20Mbps; Operating Temperature: -40°C ~ 85°C; Mounting Type: Surface Mount; Package / Case: 10-TFSOP, 10-MSOP (0.118", 3.00mm Width); Supplier Device Package: 10-MSOP; ComponentLink1URL: http://www.intersil.com/content/dam/intersil/documents/isl3/isl3170e-71e-72e-73e-74e-75e-76e-77e-78e.pdf; ComponentLink1Description: http://www.intersil.com/content/dam/intersil/documents/isl3/isl3170e-71e-72e-73e-74e-75e-76e-77e-78e.pdf
U13 = TPS1H200AQDGNRQ1: SINGLE CHANNEL HIGH SIDE POWER S; Manufacturer: Texas Instruments; Number of Channels: 1; CategorySort: 600; Supplier 1: Digi-Key; Manufacturer Part Number: TPS1H200AQDGNRQ1; Stock 1: 8489; Pricing 1: 1 = 1.59000, 10 = 1.43000, 100 = 1.14960, 500 = 0.94452, 1000 = 0.78259 (USD); RoHS: No; Min Operating Temperature: -40°C; Max Operating Temperature: 125°C; ComponentLink1URL: http://www.ti.com/lit/ds/symlink/tps1h200a-q1.pdf?src-supplier=Digi-Key; ComponentLink1Description: http://www.ti.com/lit/ds/symlink/tps1h200a-q1.pdf?src-supplier=Digi-Key; Supplier Part Number 1: 296-50416-1-ND; Category: Integrated Circuits; Value: TPS1H200AQDGNRQ1
U14 = OPA322AIDBVT: IC OPAMP GP 20MHZ RRO SOT23-5; Manufacturer: Texas Instruments; Number of Channels: 1; Min Supply Voltage: 1.8V; Max Supply Voltage: 5.5V; Slew Rate: 10V/µs; Input Bias Current: 10pA; Input Offset Voltage (Vos): 2mV; Voltage Gain: 130dB; Common Mode Rejection Ratio: 90dB; Operating Supply Current: 1.6mA; Nominal Supply Current: 1.5mA; Output Current per Channel: 65mA; Min Dual Supply Voltage: 900mV; Max Dual Supply Voltage: 2.75V; Power Supply Rejection Ratio (PSRR): 100dB; Max Frequency: 10MHz; Manufacturer Part Number: OPA322AIDBVT; Value: OPA322AIDBVT; Supplier 1: Digi-Key; Supplier Part Number 1: 296-29511-1-ND; RoHS: Yes; Category: Amplifiers - Op Amps, Buffer, Instrumentation; Stock: 3683; Pricing: 1=1.66000, 10=1.49500, 25=1.41000, 100=1.12800 (USD); Case/Package: SOT-23; Number of Pins: 5; Min Operating Temperature: -40°C; Max Operating Temperature: 125°C; Packaging: Tape and Reel; Package Quantity: 250; Number of Circuits: 1; Gain Bandwidth Product: 20MHz; Unity Gain Bandwidth Product: 20MHz; Number of Elements: 1; Max I/O Voltage: 2mV; Nominal Gain Bandwidth Product: 20MHz; Output Current: 65mA; Bandwidth: 20MHz; Number of Amplifiers: 1; Operating Supply Voltage: 2.75V; Length: 3.05mm; Height: 1.3mm; Width: 1.75mm; Radiation Hardening: No; Lead Free: Lead Free; REACH SVHC: No SVHC; ComponentLink1URL: https://datasheet.ciiva.com/1803/opa322-1803459.pdf?src-supplier=Digi-Key; ComponentLink1Description: https://datasheet.ciiva.com/1803/opa322-1803459.pdf?src-supplier=Digi-Key; ComponentLink2URL: https://datasheet.ciiva.com/7848/1481239-7848179.pdf?src-supplier=Element14; ComponentLink2Description: https://datasheet.ciiva.com/7848/1481239-7848179.pdf?src-supplier=Element14; ComponentLink3URL: https://datasheet.ciiva.com/1803/opa322-1803460.pdf?src-supplier=Digi-Key; ComponentLink3Description: https://datasheet.ciiva.com/1803/opa322-1803460.pdf?src-supplier=Digi-Key; ComponentLink4URL: https://datasheet.ciiva.com/1803/opa322-1803461.pdf?src-supplier=Digi-Key; ComponentLink4Description: https://datasheet.ciiva.com/1803/opa322-1803461.pdf?src-supplier=Digi-Key; ComponentLink5URL: https://datasheet.ciiva.com/14460/opa4322-14460092.pdf?src-supplier=Avnet; ComponentLink5Description: https://datasheet.ciiva.com/14460/opa4322-14460092.pdf?src-supplier=Avnet; ComponentLink6URL: https://datasheet.ciiva.com/48706/001071938-da-01-en-ic-opamp-gp-rr-opa322aidbvt-sot-23-5-tid-48706602.pdf?src-supplier=Conrad; ComponentLink6Description: https://datasheet.ciiva.com/48706/001071938-da-01-en-ic-opamp-gp-rr-opa322aidbvt-sot-23-5-tid-48706602.pdf?src-supplier=Conrad

## Sheet Encoder.SchDoc
size B; DocumentNumber: 5; SheetNumber: 5; SheetTotal: 14; PAGE_TITLE: -
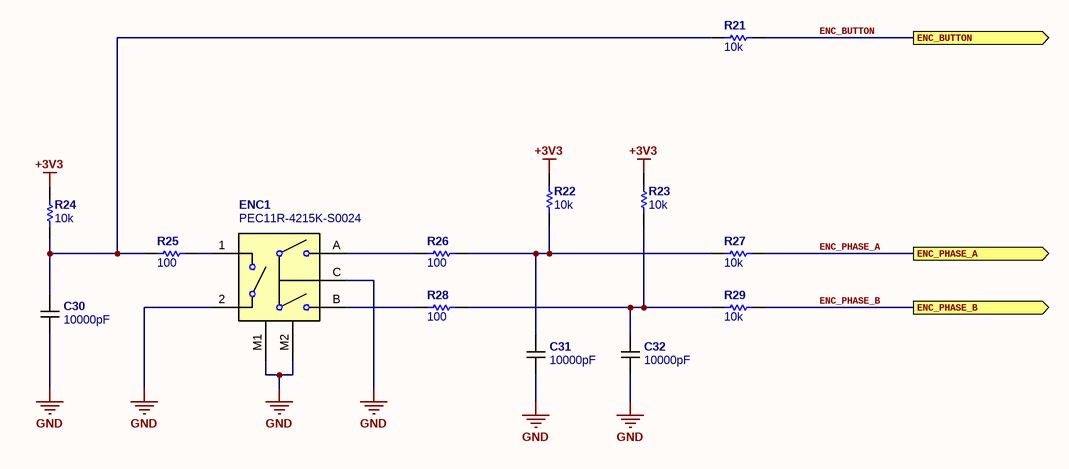
[diagram p5: Encoder.SchDoc]

### Parts
C30  10000pF  [C0603_0.90MM_HD]
C31  10000pF  [C0603_0.90MM_HD]
C32  10000pF  [C0603_0.90MM_HD]
ENC1  PEC11R-4215K-S0024  [PEC11R-4215K-S0024]
R21  10k  [R0603_0.55MM_MD]
R22  10k  [R0603_0.55MM_MD]
R23  10k  [R0603_0.55MM_MD]
R24  10k  [R0603_0.55MM_MD]
R25  100  [R0603_0.55MM_MD]
R26  100  [R0603_0.55MM_MD]
R27  10k  [R0603_0.55MM_MD]
R28  100  [R0603_0.55MM_MD]
R29  10k  [R0603_0.55MM_MD]

### Ports
ENC_BUTTON (out), ENC_PHASE_A (out), ENC_PHASE_B (out)

### Nets
+3V3: R22.2 R23.2 R24.2
GND: C30.1 C31.1 C32.1 ENC1.2 ENC1.C ENC1.M1 ENC1.M2
ENC_BUTTON: R21.1 ; port ENC_BUTTON
ENC_PHASE_A: R27.1 ; port ENC_PHASE_A
ENC_PHASE_B: R29.1 ; port ENC_PHASE_B
NetC30_2: C30.2 R21.2 R24.1 R25.2
NetC31_2: C31.2 R22.1 R26.1 R27.2
NetC32_2: C32.2 R23.1 R28.1 R29.2
NetENC1_1: ENC1.1 R25.1
NetENC1_A: ENC1.A R26.2
NetENC1_B: ENC1.B R28.2

### Notes on the sheet
- PCB REV
- Sheet
- of
- CCA REV

### Library data of the parts
C30-C32 = CGA3E2C0G1H103J080AA: CAP CER 10000PF 50V C0G 0603; Manufacturer: TDK Corporation; Temperature Coefficient: C0G, NP0; Tolerance: ±5%; Substitution Notes: 10000pF , 50V , ±5% , C0G, NP0 , -55°C ~ 125°C , AEC-Q200 , 0603; Value: 10000pF; Manufacturer Part Number: CGA3E2C0G1H103J080AA; ComponentLink1Description: Datasheet (Internal); ComponentLink1URL: datasheets\TDK\mlcc_automotive_general_en.pdf; ComponentLink2Description: Datasheet (External); ComponentLink2URL: https://product.tdk.com/info/en/catalog/datasheets/mlcc_automotive_general_en.pdf; Supplier 1: Digikey; Supplier Part Number 1: 445-6916-1-ND; Category: Capacitors; Voltage - Rated: 50V; Features: -; Operating Temperature: -55°C ~ 125°C; Ratings: AEC-Q200; Package: 0603; Thickness (Max): 0.90MM
ENC1 = PEC11R-4215K-S0024: Encoders 15mm SHAFT w/SWITCH; Manufacturer: Bourns; Number of Channels: 2; Pulses per Revolution: 24; Built in Switch: Yes; Encoder Type: Mechanical; Output Type: Quadrature,Incremental; Max Supply Voltage (DC): 5V; Hole Diameter: 1.8mm; Value: PEC11R-4215K-S0024; Supplier 1: Digi-Key; Supplier Part Number 1: PEC11R-4215K-S0024-ND; Manufacturer Part Number: PEC11R-4215K-S0024; RoHS: Yes; Category: Encoders; Stock: 2990; Pricing: 1=1.68000, 10=1.56600, 25=1.47920, 50=1.30500, 100=1.07300, 250=1.04400, 500=0.98600, 1000=0.92800, 5000=0.81200 (USD); Mount: Through Hole,Panel,PCB; Min Operating Temperature: -30°C; Max Operating Temperature: 70°C; Package Quantity: 150; Packaging: Bulk; Termination: PC Pin; Orientation: Vertical; Detent: Yes; Length: 21.5mm; Height: 13.4mm; Width: 12.5mm; REACH SVHC: No SVHC; ComponentLink1URL: https://datasheet.ciiva.com/29349/pec11r-29349515.pdf?src-supplier=Digi-Key; ComponentLink1Description: https://datasheet.ciiva.com/29349/pec11r-29349515.pdf?src-supplier=Digi-Key; ComponentLink2URL: https://datasheet.ciiva.com/30066/pec11r-221203-30066108.pdf?src-supplier=Onlinecomponents.com; ComponentLink2Description: https://datasheet.ciiva.com/30066/pec11r-221203-30066108.pdf?src-supplier=Onlinecomponents.com; ComponentLink3URL: https://datasheet.ciiva.com/12176/pec11r-221203-12176991.pdf?src-supplier=Mouser; ComponentLink3Description: https://datasheet.ciiva.com/12176/pec11r-221203-12176991.pdf?src-supplier=Mouser
R21-R24 R27 R29 = ERJ-3EKF1002V: as R15 on sheet SensorInterface; Value: 10k; Manufacturer Part Number: ERJ-3EKF1002V; ComponentLink1Description: Internal Datasheet; ComponentLink1URL: datasheets\Panasonic Electronic Components\AOA0000CE2.pdf; ComponentLink2Description: External Datasheet; ComponentLink2URL: http://industrial.panasonic.com/www-data/pdf/AOA0000/AOA0000CE2.pdf; Supplier 1: Digi-Key; Supplier Part Number 1: P10.0KHCT-ND; Category: Resistors; Resistance (Ohms): 10k; Composition: Thick Film; Features: -; Tolerance: ±1%; Package: 0603 (1608 Metric); Supplier Package: 0603; Size / Dimension: 0.063" L x 0.031" W (1.60mm x 0.80mm); Height: 0.55MM; Number of Terminations: 2; Packaging: Cut Tape (CT); Sort Value: 10000; Sort Value Package: 603_10000; Ratings: AEC-Q200
R25 R26 R28 = ERJ-3EKF1000V: as R12 on sheet SensorInterface; Value: 100; Manufacturer Part Number: ERJ-3EKF1000V; ComponentLink1Description: Internal Datasheet; ComponentLink1URL: datasheets\Panasonic Electronic Components\AOA0000CE2.pdf; ComponentLink2Description: External Datasheet; ComponentLink2URL: http://industrial.panasonic.com/www-data/pdf/AOA0000/AOA0000CE2.pdf; Supplier 1: Digi-Key; Supplier Part Number 1: P100HCT-ND; Category: Resistors; Resistance (Ohms): 100; Composition: Thick Film; Features: -; Tolerance: ±1%; Package: 0603 (1608 Metric); Supplier Package: 0603; Size / Dimension: 0.063" L x 0.031" W (1.60mm x 0.80mm); Height: 0.55MM; Number of Terminations: 2; Packaging: Cut Tape (CT); Sort Value: 100; Sort Value Package: 603_100; Ratings: AEC-Q200